# EAGLE design stair light controller (EAGLE 6.2)
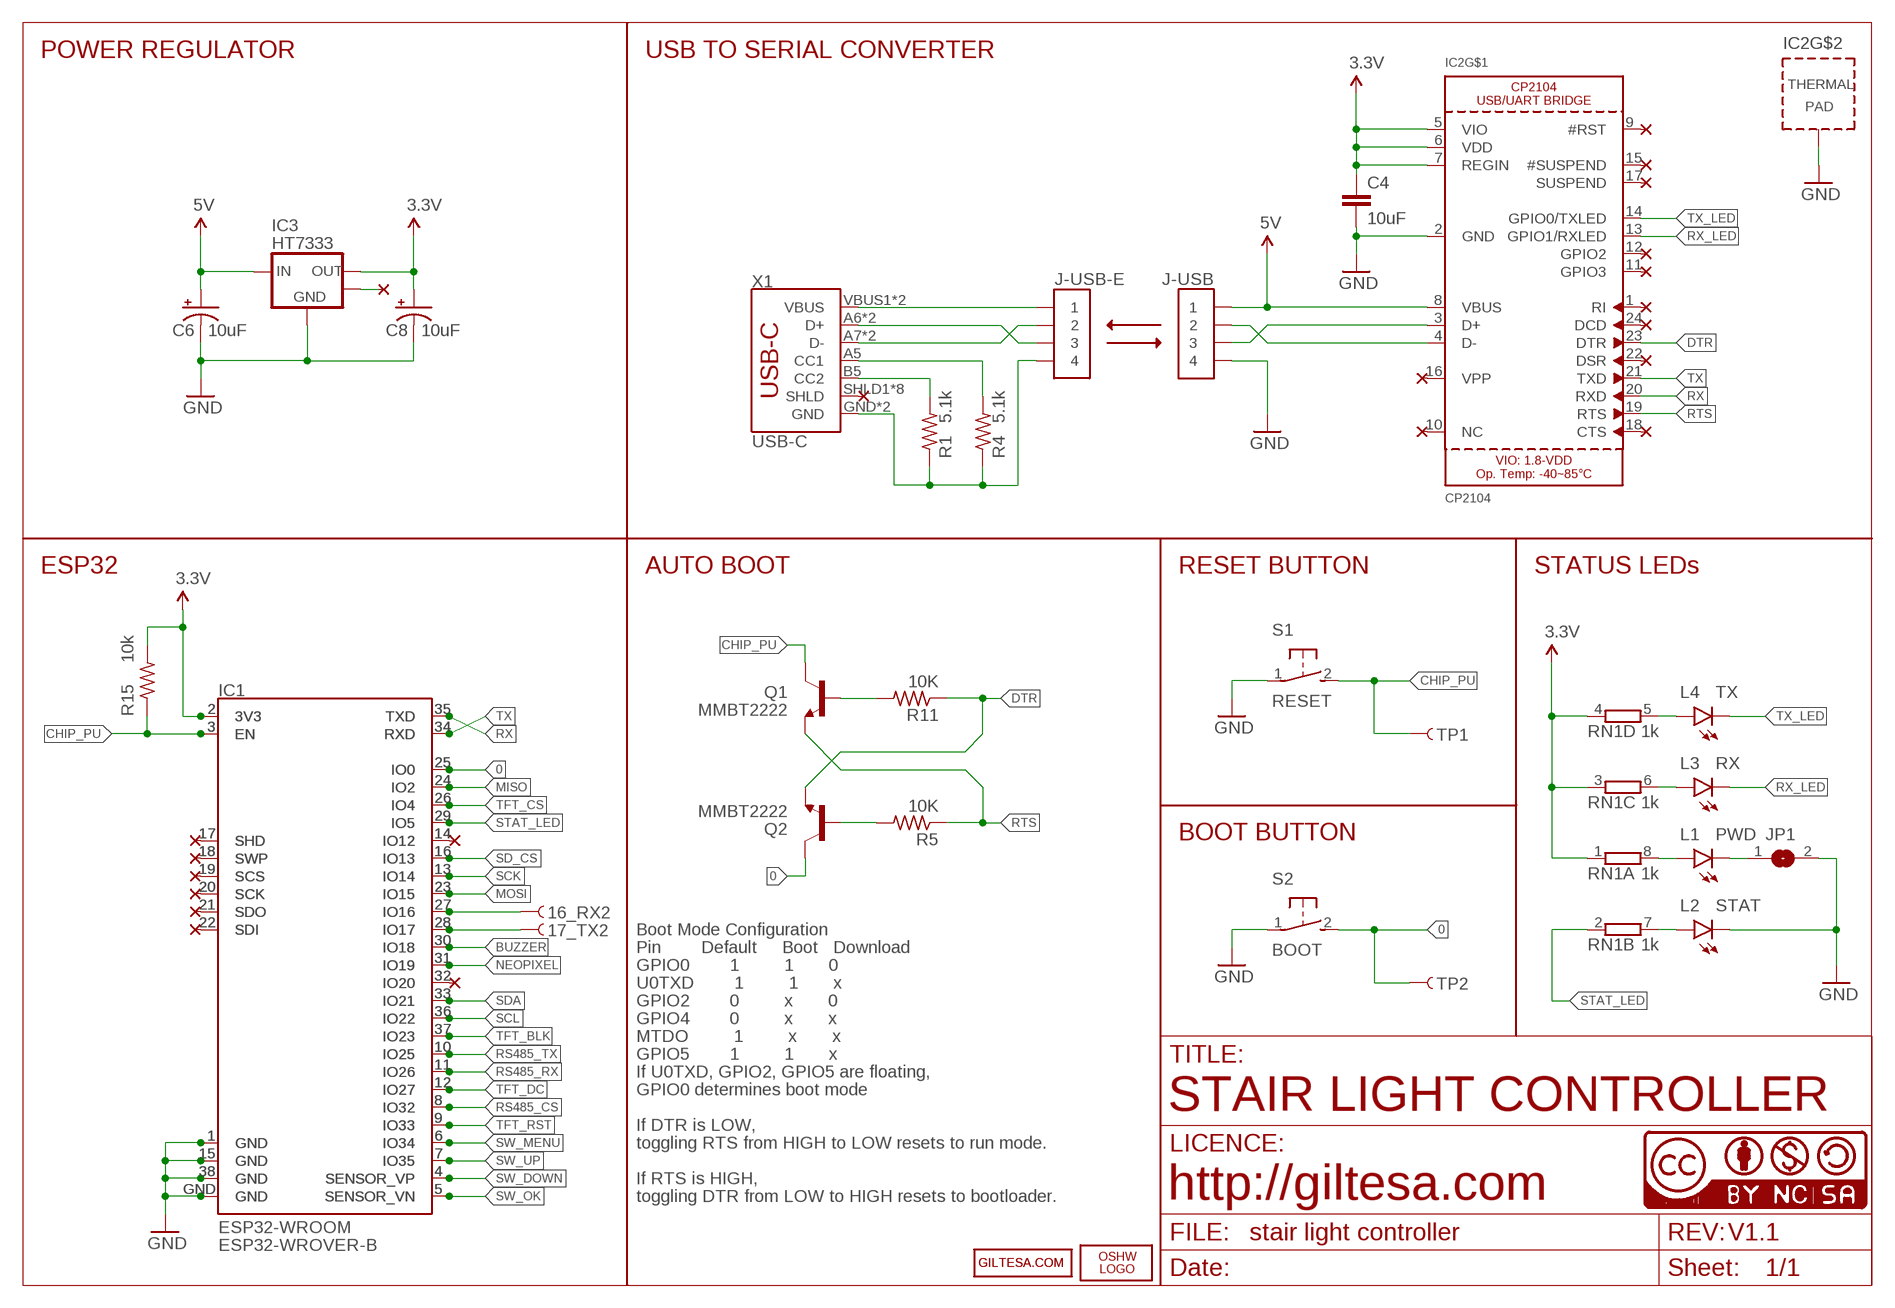
[diagram p0: schematic, sheet 1, part 1 of 2]
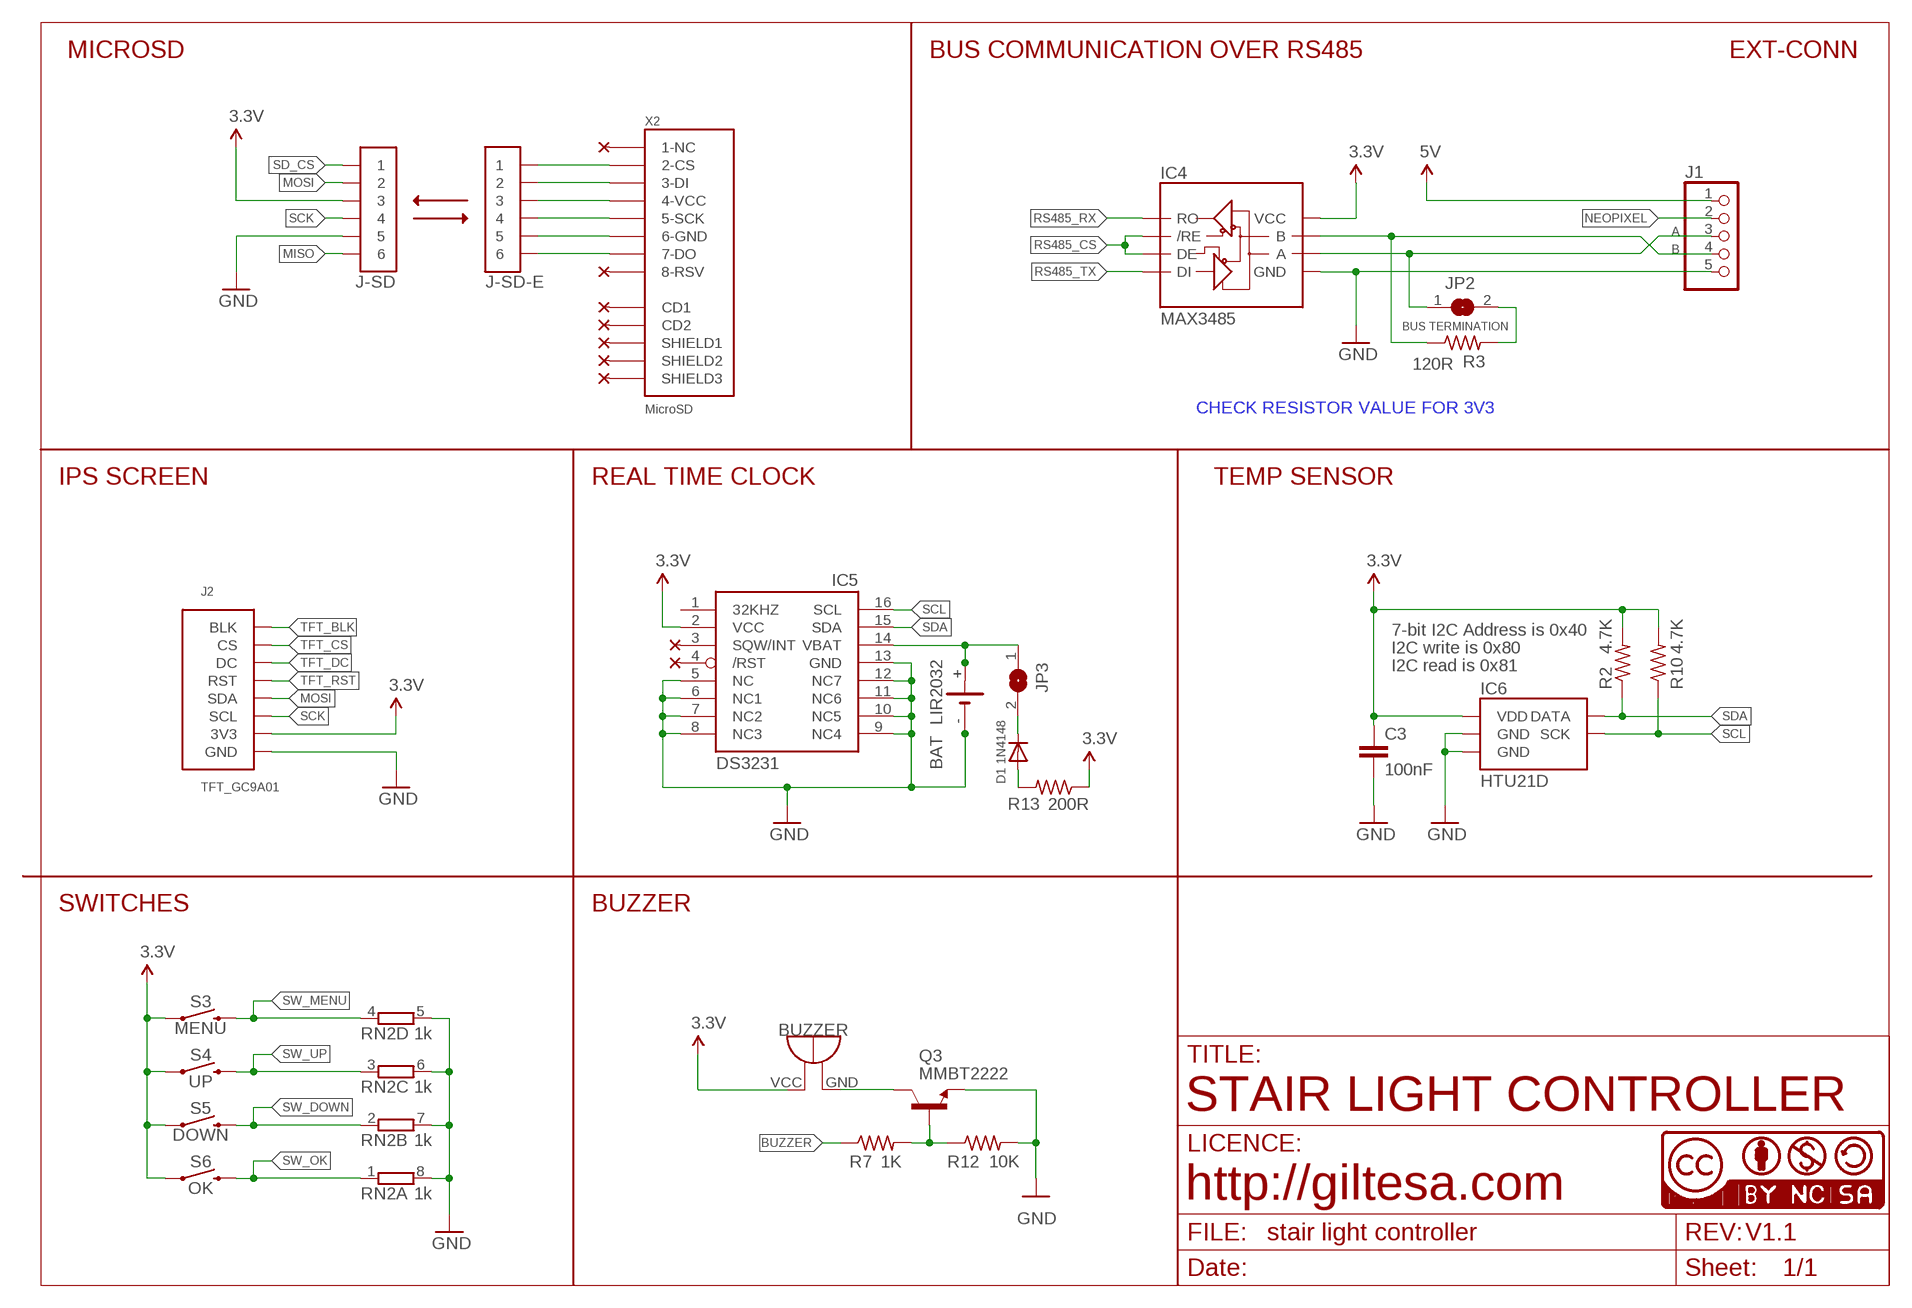
[diagram p1: schematic, sheet 1, part 2 of 2]

## Parts
16_RX2  TEST-POINTTP_15TH_THRU  [TP_15TH]
17_TX2  TEST-POINTTP_15TH_THRU  [TP_15TH]
BAT  LIR2032  LIR2032_SMD  [LIR2032_SMD]
BUZZER  BUZZER_9MM  [BUZZER_9MM]
C3  100nF  C0603  [C0603]
C4  10uF  C0805  [C0805]
C6  10uF  CAP_POL1206  [EIA3216]
C8  10uF  CAP_POL1206  [EIA3216]
D1  1N4148  DIODESOD-123  [SOD-123]
IC1  ESP32-WROVER-B  [ESP32-WROVER-B]
IC2  CP2104  [QFN24_4MM_SMSC]
IC3  HT7333  [SOT89_1]
IC4  MAX3485  RS485SOIC  [SO08]
IC5  DS3231  DS3231/SO  [SO16W]
IC6  HTU21D  HTU21DSMD  [HTU21D]
J1  PINHD-1X5  [1X05]
J2  TFT_GC9A01  LCD_GC9A01  [LCD_GC9A01]
J-SD  2X03  [2X03]
J-SD-E  2X03  [2X03]
J-USB  2X02  [2X02]
J-USB-E  2X02  [2X02]
JP1  JUMPER-SMD0402  [JUMPER-SMD_0402]
JP2  JUMPER-SMD0805  [JUMPER-SMD]
JP3  JUMPER-SMD0402  [JUMPER-SMD_0402]
L1  PWD  LED-BLUE0603  [LED-0603]
L2  STAT  LED-BLUE0603  [LED-0603]
L3  RX  LED-BLUE0603  [LED-0603]
L4  TX  LED-BLUE0603  [LED-0603]
LOGO1  OSHW_LOGO_FILLX0150-NT  [OSHW_FILLX150_NOTEXT]
Q1  MMBT2222  TRANSISTOR_NPNSOT23-3  [SOT23-3]
Q2  MMBT2222  TRANSISTOR_NPNSOT23-3  [SOT23-3]
Q3  MMBT2222  TRANSISTOR_NPNSOT23  [SOT23]
R1  5.1k  R0603  [R0603]
R2  4.7K  R0603  [R0603]
R3  120R  R0603  [R0603]
R4  5.1k  R0603  [R0603]
R5  10K  R0603  [R0603]
R7  1K  R0603  [R0603]
R10  4.7K  R0603  [R0603]
R11  10K  R0603  [R0603]
R12  10K  R0603  [R0603]
R13  200R  R0603  [R0603]
R15  10k  R0603  [R0603]
RN1  1k  4R-N0603-ARV  [0603-ARV]
RN2  1k  4R-N0603-ARV  [0603-ARV]
S1  RESET  SWITCH_2P4.6X2.8MM  [SWITCH_SMD_4.6X2.8MM]
S2  BOOT  SWITCH_2P4.6X2.8MM  [SWITCH_SMD_4.6X2.8MM]
S3  MENU  MOMENTARY-SWITCH-SPST-SMD-6.2MM-TALL  [TACTILE_SWITCH_SMD_6.2MM_TALL]
S4  UP  MOMENTARY-SWITCH-SPST-SMD-6.2MM-TALL  [TACTILE_SWITCH_SMD_6.2MM_TALL]
S5  DOWN  MOMENTARY-SWITCH-SPST-SMD-6.2MM-TALL  [TACTILE_SWITCH_SMD_6.2MM_TALL]
S6  OK  MOMENTARY-SWITCH-SPST-SMD-6.2MM-TALL  [TACTILE_SWITCH_SMD_6.2MM_TALL]
TP1  TEST-POINTTP_15TH_THRU  [TP_15TH]
TP2  TEST-POINTTP_15TH_THRU  [TP_15TH]
U1"  ESP32-WROOM  ESP32-WROOMNARROW  [ESP32-WROOM-NARROW]
U$5  CR2032SMT  [CR2032]
U$9  CC-NC-BCNIX  [CC-NC-B_NIX]
U$10  GILTESA.COM_COPPER  [GILTESA.COM_COPPER]
U$13  GILTESA.COM_MASK  [GILTESA.COM_MASK]
U$26  CC-NC-BCNIX  [CC-NC-B_NIX]
X1  USB-C  USB_C16PIN  [USB-C-16P]
X2  MicroSD  MICROSD_2  [MICROSD_2]

## Nets
0: IC1.25(IO0) Q2.3(C) S2.2(B) TP2.P$1 U1".25(IO0)
3.3V: BUZZER.VCC C3.1 C4.1 C8.A(+) IC1.2(3V3) IC2.5(VIO) IC2.6(VDD) IC2.7(REGIN) IC3.3(OUT) IC4.8(VCC) IC5.2(VCC) IC6.VDD J2.3V3 J2.3V3"(3V3) J-SD.3 R2.2 R10.2 R13.1 R15.2 RN1.1 RN1.3 RN1.4 S3.A2 S4.A2 S5.A2 S6.A2 U1".2(3V3)
5V: C6.A(+) IC2.8(VBUS) IC3.2(IN) J1.1 J-USB.1
12: IC1.14(IO12) U1".14(IO12)
16_NOT_DEV_PCB_RX2: 16_RX2.P$1 IC1.27(IO16) U1".27(IO16)
17_NOT_DEV_PCB_TX2: 17_TX2.P$1 IC1.28(IO17) U1".28(IO17)
A: IC4.6(A) J1.3 JP2.1
B: IC4.7(B) J1.4 R3.1
BUZZER: IC1.30(IO18) R7.1 U1".30(IO18)
CHIP_PU: IC1.3(EN) Q1.3(C) R15.1 S1.2(B) TP1.P$1 U1".3(EN)
D+: IC2.3(D+) J-USB.3
D-: IC2.4(D-) J-USB.2
DTR: IC2.23(DTR) Q2.2(E) R11.1
EXT_PCB_3.3V: J-SD-E.3 X2.4-VCC
EXT_PCB_5V: J-USB-E.1 X1.VBUS1(VBUS) X1.VBUS2(VBUS)
EXT_PCB_CC1: R4.2 X1.A5(CC1)
EXT_PCB_CC2: R1.2 X1.B5(CC2)
EXT_PCB_D+: J-USB-E.3 X1.A6(D+) X1.B6(D+)
EXT_PCB_D-: J-USB-E.2 X1.A7(D-) X1.B7(D-)
EXT_PCB_GND: J-SD-E.5 J-USB-E.4 R1.1 R4.1 X1.GND X1.GND2(GND) X2.6-GND
EXT_PCB_MISO: J-SD-E.6 X2.7-DO
EXT_PCB_MOSI: J-SD-E.2 X2.3-DI
EXT_PCB_SCK: J-SD-E.4 X2.5-SCK
EXT_PCB_SD_CS: J-SD-E.1 X2.2-CS
GND: BAT.- C3.2 C4.2 C6.C(-) C8.C(-) IC1.1(GND) IC1.15(GND) IC1.38(GND) IC1.GND IC2.2(GND) IC2.THERM(TP) IC3.1(GND) IC4.5(GND) IC5.5(NC) IC5.6(NC1) IC5.7(NC2) IC5.8(NC3) IC5.9(NC4) IC5.10(NC5) IC5.11(NC6) IC5.12(NC7) IC5.13(GND) IC6.7(GND) IC6.GND J1.5 J2.GND J2.GND"(GND) J-SD.5 J-USB.4 JP1.2 L2.C Q3.2(E) R12.2 RN2.5 RN2.6 RN2.7 RN2.8 S1.1(A) S2.1(A) U1".1(GND) U1".15(GND) U1".38(GND) U1".GND U$5.-
MISO: IC1.24(IO2) J-SD.6 U1".24(IO2)
MOSI: IC1.23(IO15) J2.SDA J2.SDA"(SDA) J-SD.2 U1".23(IO15)
N$1: L1.A RN1.8
N$2: L2.A RN1.7
N$3: IC3.4(NC)
N$4: BAT.+ IC5.14(VBAT) JP3.1 U$5.+
N$5: D1.A R13.2
N$6: L4.A RN1.5
N$7: L3.A RN1.6
N$13: JP1.1 L1.C
N$14: JP2.2 R3.2
N$15: Q3.1(B) R7.2 R12.1
N$18: IC1.32(IO20) U1".32(IO20)
N$19: BUZZER.GND Q3.3(C)
N$27: IC1.20(SCK) U1".20(SCK)
N$28: IC1.19(SCS) U1".19(SCS)
N$29: IC1.22(SDI) U1".22(SDI)
N$30: IC1.21(SDO) U1".21(SDO)
N$33: IC1.17(SHD) U1".17(SHD)
N$34: IC1.18(SWP) U1".18(SWP)
N$35: D1.C JP3.2
N$40: Q1.1(B) R11.2
N$41: Q2.1(B) R5.2
NEOPIXEL: IC1.31(IO19) J1.2 U1".31(IO19)
RS485_CS: IC1.8(IO32) IC4.2(/RE) IC4.3(DE) U1".8(IO32)
RS485_RX: IC1.11(IO26) IC4.1(RO) U1".11(IO26)
RS485_TX: IC1.10(IO25) IC4.4(DI) U1".10(IO25)
RTS: IC2.19(RTS) Q1.2(E) R5.1
RX: IC1.35(TXD) IC2.20(RXD) U1".35(TXD)
RX_LED: IC2.13(GPIO1/RXLED) L3.C
SCK: IC1.13(IO14) J2.SCL J2.SCL"(SCL) J-SD.4 U1".13(IO14)
SCL: IC1.36(IO22) IC5.16(SCL) IC6.SCK R10.1 U1".36(IO22)
SD_CS: IC1.16(IO13) J-SD.1 U1".16(IO13)
SDA: IC1.33(IO21) IC5.15(SDA) IC6.DATA R2.1 U1".33(IO21)
STAT_LED: IC1.29(IO5) RN1.2 U1".29(IO5)
SW_DOWN: IC1.4(SENSOR_VP) RN2.2 S5.B2 U1".4(SENSOR_VP)
SW_MENU: IC1.6(IO34) RN2.4 S3.B2 U1".6(IO34)
SW_OK: IC1.5(SENSOR_VN) RN2.1 S6.B2 U1".5(SENSOR_VN)
SW_UP: IC1.7(IO35) RN2.3 S4.B2 U1".7(IO35)
TFT_BLK: IC1.37(IO23) J2.BLK J2.BLK"(BLK) U1".37(IO23)
TFT_CS: IC1.26(IO4) J2.CS J2.CS"(CS) U1".26(IO4)
TFT_DC: IC1.12(IO27) J2.DC J2.DC"(DC) U1".12(IO27)
TFT_RST: IC1.9(IO33) J2.RST J2.RST"(RST) U1".9(IO33)
TX: IC1.34(RXD) IC2.21(TXD) U1".34(RXD)
TX_LED: IC2.14(GPIO0/TXLED) L4.C
Unconnected: IC2.1(RI) IC2.9(#RST) IC2.10(NC) IC2.11(GPIO3) IC2.12(GPIO2) IC2.15(#SUSPEND) IC2.16(VPP) IC2.17(SUSPEND) IC2.18(CTS) IC2.22(DSR) IC2.24(DCD) IC5.1(32KHZ) IC5.3(SQW/INT) IC5.4(/RST) X1.SHLD1(SHLD) X1.SHLD2(SHLD) X1.SHLD3(SHLD) X1.SHLD4(SHLD) X1.SHLD5(SHLD) X1.SHLD6(SHLD) X1.SHLD7(SHLD) X1.SHLD8(SHLD) X2.1-NC X2.8-RSV X2.CD1 X2.CD2 X2.SHIELD1 X2.SHIELD2 X2.SHIELD3

## Notes on the sheet
- POWER REGULATOR | USB TO SERIAL CONVERTER | MICROSD | BUS COMMUNICATION OVER RS485 | EXT-CONN
- BUS TERMINATION
- CHECK RESISTOR VALUE FOR 3V3
- IPS SCREEN | REAL TIME CLOCK | TEMP SENSOR
- ESP32 | AUTO BOOT | RESET BUTTON | STATUS LEDs
- 7-bit I2C Address is 0x40
- I2C write is 0x80
- I2C read is 0x81
- BOOT BUTTON
- SWITCHES | BUZZER
- Boot Mode Configuration
- Pin        Default     Boot   Download
- GPIO0        1         1       0
- U0TXD        1         1       x
- GPIO2        0         x       0
- GPIO4        0         x       x
- MTDO         1         x       x
- GPIO5        1         1       x
- If U0TXD, GPIO2, GPIO5 are floating,
- GPIO0 determines boot mode
- STAIR LIGHT CONTROLLER | STAIR LIGHT CONTROLLER
- If DTR is LOW,
- toggling RTS from HIGH to LOW resets to run mode.
- If RTS is HIGH,
- toggling DTR from LOW to HIGH resets to bootloader. | http://giltesa.com | http://giltesa.com
- V1.1 | V1.1

## Library data of the parts
16_RX2 17_TX2 TP1 TP2 = SparkFun-Connectors:TEST-POINT: SparkFun Test Points Bare copper test points for troubleshooting or In-Circuit-Testing. These are used by our Production team for verifying production board runs using pogo-pins on test beds. SparkFun Products: SparkFun LSM9DS1 Breakout <https://www.sparkfun.com/products/13284> SparkFun PSOC <https://www.sparkfun.com/products/13714> SparkFun Load Cell Amplifier <https://www.sparkfun.com/products/13879>
BAT = ,giltesa:LIR2032_SMD
BUZZER = ,giltesa:BUZZER
C3 = ,giltesa:C0603
C4 = ,giltesa:C0805
C6 C8 = SparkFun:CAP_POL: Capacitor Polarized These are standard SMD and PTH capacitors. Normally 10uF, 47uF, and 100uF in electrolytic and tantalum varieties. Always verify the external diameter of the through hole cap, it varies with capacity, voltage, and manufacturer. The EIA devices should be standard.
D1 = adafruit:DIODE: Diode SMADIODE - SMA Surface Mount Package 20V 1A Schottky Diode Digikey: 641-1014-6-ND DO-1N4148 - Through Hole Small Current Diode SOD-123 20V 1 A (.5mV Vf) Schottky Diode - Digikey: MBRX120TPMSCT-ND SOD-323 10V 570mA (.38mV Vf, 3ns) Schottky Diode - Digikey: ZLLS410CT-ND SOD-523 30V 30mA Schottky Diode (RB751S-40TE61) - Digikey: RB751S-40TE61CT-ND SOT23-R/W - SOT23 Package (R = Solder Paste/Reflow Ovens, W = Hand-Soldering) BAT54Film 40V 300mA - Digikey: 497-7162-1-ND
IC1 = ,giltesa:ESP32-WROVER-B
IC2 = microbuilder:CP2104: CP2104 - USB to UART Bridge VDD Output: 3.45V
IC3 = ,giltesa:HT7
IC4 = SparkFun-DigitalIC:RS485: RS485 transceiver
IC5 = adafruit:DS3231
IC6 = SparkFun-Sensors:HTU21D
J1 = pinhead:PINHD-1X5: PIN HEADER
J2 = ,giltesa:LCD_GC9A01
J-SD J-SD-E = ,giltesa:2X03
J-USB J-USB-E = ,giltesa:2X02
JP1-JP3 = ,giltesa:JUMPER-SMD
L1-L4 = SparkFun-LED:LED-BLUE: Blue SMD LED Used in manufacturing of various products at SparkFun Packages: 0603 - SMD 0603 package [Product Link] <http://www.digikey.com/product-detail/en/SMLE12BC7TT86/511-1589-2-ND/1641808> 1206 - SMD1206 package [Product Link] <http://www.digikey.com/product-detail/en/lite-on-inc/LTST-C150TBKT/160-1643-1-ND/573584> SparkFun Products: ESP8266 Thing-Dev Board <https://www.sparkfun.com/products/13711> RedBoard <https://www.sparkfun.com/products/12757>; PROD_ID: DIO-08575; VALUE: BLUE
LOGO1 = ohw-logo:OSHW_LOGO_FILL
Q1-Q3 = SparkFun:TRANSISTOR_NPN: Transistor NPN BJT configuration in SOT23 package. MMBT2222 is the common NPN we use. Double check BCE configuration again layout.
R1-R5 R7 R10-R13 R15 = ,giltesa:R0603
RN1 RN2 = resistor-dil:4R-N: Array Chip Resistor Source: RS Component / Phycomp; OC_FARNELL: unknown; OC_NEWARK: unknown
S1 S2 = ,giltesa:SWITCH_2P
S3-S6 = SparkFun-Switches:MOMENTARY-SWITCH-SPST: Momentary Switch (Pushbutton) - SPST Normally-open (NO) SPST momentary switches (buttons, pushbuttons). Variants PTH-12MM - 12mm square, through-hole Momentary Pushbutton Switch - 12mm Square <https://www.sparkfun.com/products/9190> (COM-09190) PTH-6.0MM, PTH-6.0MM-KIT - 6.0mm square, through-hole Mini Pushbutton Switch <https://www.sparkfun.com/products/97> (COM-00097) KIT package intended for soldering kit's - only one side of pads' copper is exposed. PTH-RIGHT-ANGLE-KIT - Right-angle, through-hole Right Angle Tactile Button <https://www.sparkfun.com/products/10791> - Used on SparkFun BigTime Watch Kit <https://www.sparkfun.com/products/11734> SMD-12MM - 12mm square, surface-mount Tactile Button - SMD (12mm) <https://www.sparkfun.com/products/12993> (COM-12993) Used on SparkFun PicoBoard <https://www.sparkfun.com/products/11888> SMD-4.5MM - 4.5mm Square Trackball Switch Used on SparkFun Blackberry Trackballer Breakout <https://www.sparkfun.com/products/13169> SMD-4.6MMX2.8MM - 4.60mm x 2.80mm, surface mount Used on SparkFun SAMD21 Mini Breakout <https://www.sparkfun.com/products/13664> SMD-5.2MM, SMD-5.2-REDUNDANT - 5.2mm square, surface-mount Mini Pushbutton Switch - SMD <https://www.sparkfun.com/products/8720> (COM-08720) Used on Arduino Pro Mini <https://www.sparkfun.com/products/11114> REDUNDANT package connects both switch circuits together SMD-6.0X3.5MM - 6.0 x 3.5mm, surface mount Momentary Reset Switch SMD <https://www.sparkfun.com/products/8229> (COM-08229) SMD-6.2MM-TALL - 6.2mm square, surface mount Tactile Button - SMD (6mm) <https://www.sparkfun.com/products/12992> Used on SparkFun Digital Sandbox <https://www.sparkfun.com/products/12651> SMD-RIGHT-ANGLE - Right-angle, surface mount Used on SparkFun Block for Intel® Edison - Arduino <https://www.sparkfun.com/products/13036>; PROD_ID: SWCH-11966; SF_SKU: COM-12992
U1" = ,giltesa:ESP32-WROOM; PROD_ID: IC-13849
U$5 = ,giltesa:CR2032
U$9 U$26 = cc-by-nc-sa:CC-NC-BC: All hardware is licensed under the Creative Commons Attribution-Noncommercial-Share Alike 2.5 Switzerland License. To view a copy of this license, visit http://creativecommons.org/licenses/by-nc-sa/2.5/ch/ or send a letter to Creative Commons, 171 Second Street, Suite 300, San Francisco, California, 94105, USA.
U$10 U$13 = ,giltesa_logos:GILTESA.COM
X1 = SparkFun-Connectors:USB_C: USB Type C 16Pin Connector Super Speed pins not available on the 16-pin purely SMD connector so this part is best for USB 2.0 implementations. D1 and D2 are tied together enabling D+/- no matter which way the cable is plugged into the connector. The two channel configuration pins (CC1/2) are exposed. These are normally connected to ground via 5.1k resistors but can be reconfigured for high current/high power applications.; PROD_ID: CONN-14122
X2 = ,giltesa:MICROSD_2

## Net classes
1 power: width 0.178 mm
2 gnd: width 0.305 mm, drill 0.406 mm, clearance 0.203 mm
3 power usb: width 0.508 mm, drill 0.406 mm, clearance 0.203 mm
4 aref: width 0.254 mm, drill 0.61 mm, clearance 0.254 mm

## Board
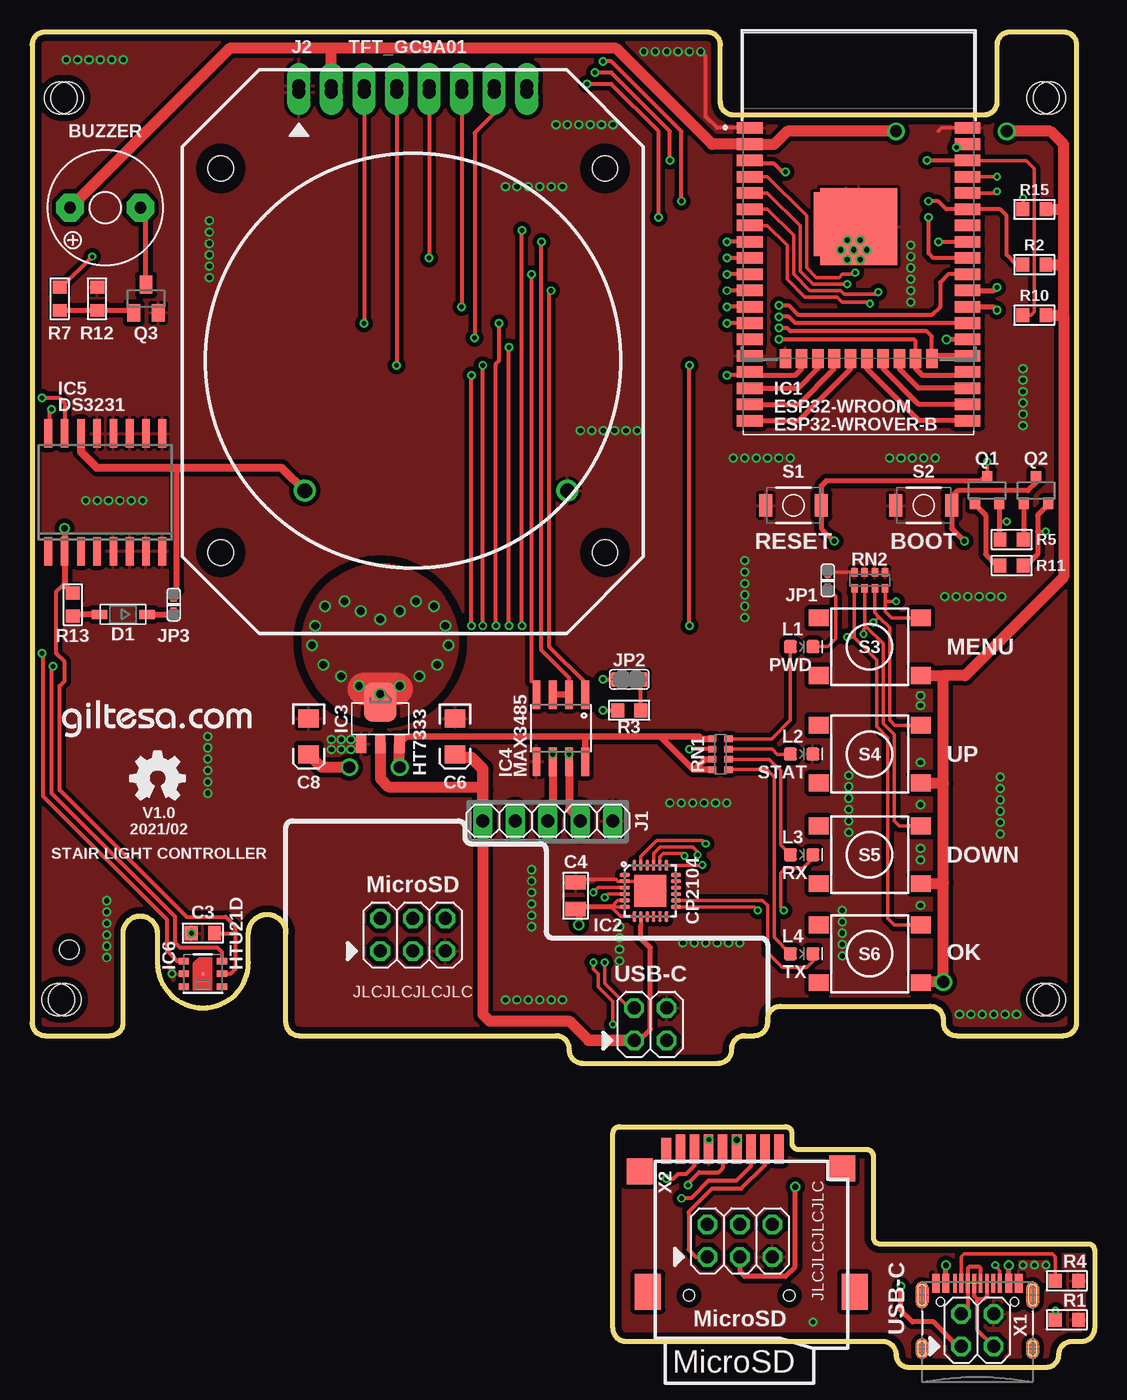
[diagram p2: board, top side]
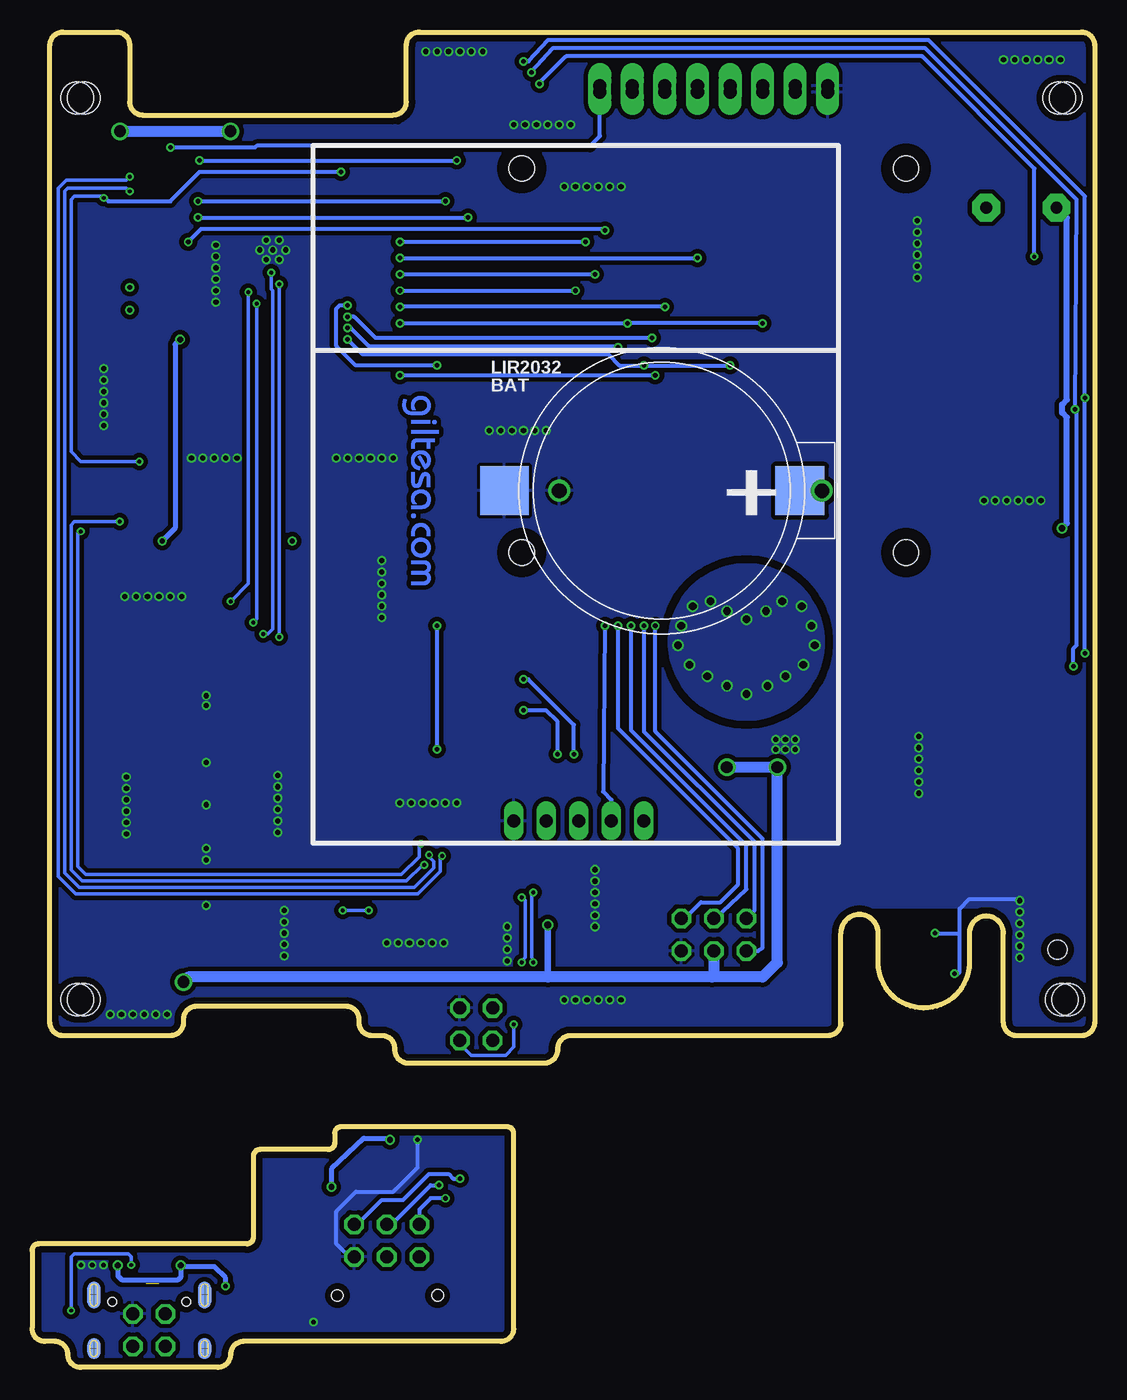
[diagram p3: board, bottom side, seen from below]

Size 82.93 x 104.27 mm. Coordinates in mm from the lower left corner, seen from the top.
Outline: 7.11,33.91 arc-180 9.78,33.91 9.78,31.62 arc180 16.89,31.62 16.89,33.91 arc-180 19.81,33.91 19.81,26.92 arc90 20.83,25.91 40.89,25.91 arc-90 41.91,24.89 arc90 42.93,23.75 53.59,23.75 arc90 54.61,24.89 arc-90 55.63,25.91 56.39,25.91 arc90 57.4,26.92 57.4,27.18 arc-90 58.42,28.19 70.1,28.19 arc-90 71.12,27.18 71.12,26.92 arc90 72.14,25.91 80.52,25.91 arc90 81.53,26.92 81.53,103.25 arc90 80.52,104.27 76.33,104.27 arc90 75.31,103.25 75.31,98.81 arc-90 74.3,97.79 54.74,97.79 arc-90 53.72,98.81 53.72,103.25 arc90 52.7,104.27 1.02,104.27 arc90 0,103.25 0,26.92 arc90 1.02,25.91 6.1,25.91 arc90 7.11,26.92 7.11,33.91
Outline: 45.34,3.05 arc90 46.35,2.03 66.42,2.03 arc-90 67.44,1.02 arc90 68.45,0 79.12,0 arc90 80.14,1.02 arc-90 81.15,2.03 81.92,2.03 arc90 82.93,3.05 82.93,9.14 arc90 82.42,9.65 66.17,9.65 arc-90 65.66,10.16 65.66,16.51 arc90 65.15,17.02 59.82,17.02 arc-90 59.31,17.53 59.31,18.29 arc90 58.8,18.8 45.85,18.8 arc90 45.34,18.29 45.34,3.05
Copper layers (1*16): Top 0.035mm / dielectric 1.6mm / Bottom 0.035mm
Design rules: minimum track width 6mil, minimum drill 12mil, track to track 6mil, track to pad 6mil, pad to pad 6mil, via to via 8mil, smd to smd 0mil, copper to edge 20mil, drill to drill 10mil, minimum pad ring 6mil, minimum via ring 6mil, stop-mask expansion 0mil, vias tented up to drill 100mil, thermal gap 10mil
Holes 2.54 mm at 2.05,28.72 2.25,99.12 78.9,28.72 78.9,99.12 2.75,99.12 2.55,28.72 79.41,99.12 79.41,28.72
Holes 1.52 mm at 2.9,32.62
tRestrict: 4 lines
bRestrict: area 9.4,27.7 to 17.3,35.3; 4 lines

### Footprints (pad centres in the part's own frame; a part is rotated, then mirrored left to right if it is on the bottom)
TP_15TH = drill 0.381 pad 0.61: P$1 0,0
LIR2032_SMD = smd 3.81 x 3.81: + 10.78,0; - -12.28,0
BUZZER_9MM = drill 0.914 pad 2.159 octagon: GND -2.743,0; VCC 2.743,0
C0603 = smd 1 x 1.1: 1 -0.901,0; 2 0.901,0
C0805 = smd 1.1 x 1.6: 1 -1.05,0; 2 1.05,0
EIA3216 = smd 1.4 x 1.6: A 1.4,0; C -1.4,0
SOD-123 = smd 1.2 x 0.7: A 1.85,0; C -1.85,0
ESP32-WROVER-B = smd 2 x 0.9: 1 -8.5,8.26; 2 -8.5,6.99; 3 -8.5,5.72; 4 -8.5,4.45; 5 -8.5,3.18; 6 -8.5,1.91; 7 -8.5,0.64; 8 -8.5,-0.63; 9 -8.5,-1.9; 10 -8.5,-3.17; 11 -8.5,-4.44; 12 -8.5,-5.71; 13 -8.5,-6.98; 14 -8.5,-8.25; 15 -8.5,-9.52; 16 -8.5,-10.79; 17 -8.5,-12.06; 18 -8.5,-13.33; 19 -8.5,-14.6; 20 8.5,-14.6; 21 8.5,-13.33; 22 8.5,-12.06; 23 8.5,-10.79; 24 8.5,-9.52; 25 8.5,-8.25; 26 8.5,-6.98; 27 8.5,-5.71; 28 8.5,-4.44; 29 8.5,-3.17; 30 8.5,-1.9; 31 8.5,-0.63; 32 8.5,0.64; 33 8.5,1.91; 34 8.5,3.18; 35 8.5,4.45; 36 8.5,5.72; 37 8.5,6.99; 38 8.5,8.26 | smd 5 x 5: GND -1,0.76
QFN24_4MM_SMSC = smd 0.8 x 0.28: 1 -2,1.25; 2 -2,0.75; 3 -2,0.25; 4 -2,-0.25; 5 -2,-0.75; 6 -2,-1.25; 13 2,-1.25; 14 2,-0.75; 15 2,-0.25; 16 2,0.25; 17 2,0.75; 18 2,1.25 | smd 0.28 x 0.8: 7 -1.25,-2; 8 -0.75,-2; 9 -0.25,-2; 10 0.25,-2; 11 0.75,-2; 12 1.25,-2; 19 1.25,2; 20 0.75,2; 21 0.25,2; 22 -0.25,2; 23 -0.75,2; 24 -1.25,2 | smd 2.5 x 2.5: THERM 0,0
SOT89_1 = smd 0.8 x 1.4: 1 -1.499,-1.981; 2 0,-1.981; 3 1.499,-1.981 | smd 2.54 x 3.048: 4 0,1.27
SO08 = smd 0.61 x 2.21: 1 -1.905,-2.616; 2 -0.635,-2.616; 3 0.635,-2.616; 4 1.905,-2.616; 5 1.905,2.616; 6 0.635,2.616; 7 -0.635,2.616; 8 -1.905,2.616
SO16W = smd 0.6 x 2.2: 1 -4.445,-4.6; 2 -3.175,-4.6; 3 -1.905,-4.6; 4 -0.635,-4.6; 5 0.635,-4.6; 6 1.905,-4.6; 7 3.175,-4.6; 8 4.445,-4.6; 9 4.445,4.6; 10 3.175,4.6; 11 1.905,4.6; 12 0.635,4.6; 13 -0.635,4.6; 14 -1.905,4.6; 15 -3.175,4.6; 16 -4.445,4.6
HTU21D = smd 0.2 x 0.2: 7 0,0 | smd 0.8 x 0.5: DATA 1.5,-1; GND 1.5,0; NC@1 -1.5,1; NC@6 1.5,1; SCK -1.5,-1; VDD -1.5,0
1X05 = drill 1.016 long: 1 -5.08,0; 2 -2.54,0; 3 0,0; 4 2.54,0; 5 5.08,0
LCD_GC9A01 = drill 1.016 pad 1.778 long: 3V3 -6.35,21.454; 3V3" -6.35,20.946; BLK 8.89,21.454; BLK" 8.89,20.946; CS 6.35,21.454; CS" 6.35,20.946; DC 3.81,21.454; DC" 3.81,20.946; GND -8.89,21.454; GND" -8.89,20.946; RST 1.27,21.454; RST" 1.27,20.946; SCL -3.81,21.454; SCL" -3.81,20.946; SDA -1.27,21.454; SDA" -1.27,20.946 | hole 2: -15,-15; 15,-15; -15,15; 15,15
2X03 = drill 1.016 octagon: 1 -2.54,-1.27; 2 -2.54,1.27; 3 0,-1.27; 4 0,1.27; 5 2.54,-1.27; 6 2.54,1.27
2X02 = drill 1.016 octagon: 1 -1.27,-1.27; 2 -1.27,1.27; 3 1.27,-1.27; 4 1.27,1.27
JUMPER-SMD_0402 = smd 0.7 x 0.5: 1 -0.584,0; 2 0.584,0
JUMPER-SMD = smd 1.15 x 1.1: 1 -0.838,0; 2 0.838,0
LED-0603 = smd 1 x 1: A -0.877,0; C 0.877,0
SOT23-3 = smd 0.8 x 0.9: 1 -0.95,-1; 2 0.95,-1; 3 0,1.1
SOT23 = smd 1 x 1.4: 1 -0.95,-1.1; 2 0.95,-1.1; 3 0,1.1
R0603 = smd 1 x 1.1: 1 -0.901,0; 2 0.901,0
0603-ARV = smd 0.5 x 0.65: 1 -1.2,-0.625; 2 -0.4,-0.625; 3 0.4,-0.625; 4 1.2,-0.625; 5 1.2,0.625; 6 0.4,0.625; 7 -0.4,0.625; 8 -1.2,0.625
SWITCH_SMD_4.6X2.8MM = smd 1.016 x 1.778: 1 -2.177,0; 2 2.177,0
TACTILE_SWITCH_SMD_6.2MM_TALL = smd 1.55 x 1.3: A1 -3.975,-2.25; A2 3.975,-2.25; B1 -3.975,2.25; B2 3.975,2.25
ESP32-WROOM-NARROW = smd 1.5 x 0.9: 1 -8.238,6.43; 2 -8.238,5.16; 3 -8.238,3.89; 4 -8.238,2.62; 5 -8.238,1.35; 6 -8.238,0.08; 7 -8.238,-1.19; 8 -8.238,-2.46; 9 -8.238,-3.73; 10 -8.238,-5; 11 -8.238,-6.27; 12 -8.238,-7.54; 13 -8.238,-8.81; 14 -8.238,-10.08; 25 8.238,-10.08; 26 8.238,-8.81; 27 8.238,-7.54; 28 8.238,-6.27; 29 8.238,-5; 30 8.238,-3.73; 31 8.238,-2.46; 32 8.238,-1.19; 33 8.238,0.08; 34 8.238,1.35; 35 8.238,2.62; 36 8.238,3.89; 37 8.238,5.16; 38 8.238,6.43 | smd 0.9 x 1.5: 15 -5.715,-11.57; 16 -4.445,-11.57; 17 -3.175,-11.57; 18 -1.905,-11.57; 19 -0.635,-11.57; 20 0.635,-11.57; 21 1.905,-11.57; 22 3.175,-11.57; 23 4.445,-11.57; 24 5.715,-11.57 | smd 6 x 6: GND 0,-1.27
CR2032 = drill 1.143: + -12.5,0; - 8,0
USB-C-16P = smd 0.3 x 1.45: A5 -1.25,0; A6 -0.25,0; A7 0.25,0; A8 1.25,0; B5 1.75,0; B6 0.75,0; B7 -0.75,0; B8 -1.75,0 | smd 0.6 x 1.45: GND -3.225,0; GND2 3.225,0 | smd 1 x 2.1: SHLD1 -4.32,-0.915; SHLD2 4.32,-0.915 | smd 1 x 2.1 bottom: SHLD3 -4.32,-0.915; SHLD4 4.32,-0.915 | smd 1 x 1.6: SHLD5 -4.32,-5.095; SHLD8 4.32,-5.095 | smd 1 x 1.6 bottom: SHLD6 -4.32,-5.095; SHLD7 4.32,-5.095 | smd 0.55 x 1.45: VBUS1 -2.45,0; VBUS2 2.45,0 | hole 0.65: -2.89,-1.445; 2.89,-1.445
MICROSD_2 = smd 2.286 x 0.75: 1-NC -0.963,9.652; 2-CS -0.963,8.552; 3-DI -0.963,7.452; 4-VCC -0.963,6.352; 5-SCK -0.963,5.252; 6-GND -0.963,4.152; 7-DO -0.963,3.052; 8-RSV -0.963,1.952 | smd 2.033 x 0.75: CD1 -0.836,0.852 | smd 2.032 x 2.032: CD2 0.773,-1.22; SHIELD1 0.519,14.578 | smd 2.794 x 2.032: SHIELD2 10.171,15.544; SHIELD3 10.171,-0.585 | hole 0.9: 10.45,2.62; 10.46,10.45

### Placement (x,y rotation side)
16_RX2  75.31,82.55 180 top
17_TX2  75.31,84.33 180 top
BAT  33.78,68.45 0 bottom
BUZZER  5.71,90.55 180 top
C3  13.34,33.91 180 top
C4  42.42,36.83 90 top
C6  33.02,49.28 270 top
C8  21.59,49.28 270 top
D1  7.11,58.8 180 top
IC1  64.52,88.52 0 top
IC2  48.26,37.21 0 top
IC3  27.18,50.67 0 top
IC4  41.27,49.91 180 top
IC5  5.71,68.33 0 top
IC6  13.34,30.73 180 top
J1  40.26,42.67 0 top
J2  29.72,78.61 0 top
J-SD  29.72,33.78 0 top
J-SD-E  55.24,9.91 0 top
J-USB  48.26,26.8 0 top
J-USB-E  73.79,2.92 0 top
JP1  62.1,61.46 90 top
JP2  46.61,53.72 0 top
JP3  11.05,59.56 270 top
L1  60.07,56.27 0 top
L2  60.07,47.89 0 top
L3  60.07,40.03 0 top
L4  60.07,32.3 0 top
LOGO1  7.67,44.32 0 top
Q1  74.55,68.45 0 top
Q2  78.36,68.45 0 top
Q3  8.89,83.44 0 top
R1  80.77,3.73 180 top
R2  78.23,86.11 0 top
R3  46.61,51.31 0 top
R4  80.77,6.78 180 top
R5  76.45,64.64 0 top
R7  2.16,83.44 270 top
R10  78.23,82.17 0 top
R11  76.45,62.61 180 top
R12  5.08,83.44 90 top
R13  3.17,59.56 270 top
R15  78.23,90.42 0 top
RN1  53.72,47.88 270 top
RN2  65.38,61.47 0 top
S1  59.44,67.31 0 top
S2  69.6,67.31 0 top
S3  65.38,56.27 0 top
S4  65.38,47.89 0 top
S5  65.38,40.03 0 top
S6  65.38,32.3 0 top
TP1  62.61,64.52 270 top
TP2  72.77,64.52 270 top
U1"  64.52,90.35 0 top
U$5  33.78,68.45 180 bottom
U$9  -0.03,26.42 0 top
U$10  54.1,75.95 270 bottom
U$13  2.26,49.15 0 top
U$26  0,26.42 0 top
X1  73.78,6.57 0 top
X2  48.65,16.08 270 top

### Tracks (layer width: path | path; a pad name or v marks a point on that pad's centre or on a via)
0  (via drill 0.46)
  Top 0.406: IC1.25 U1".25 v71.38,80.27 v71.37,80.26 | TP2.P$1 71.77,65.51 S2.2 71.75,67.33 71.75,67.95 72.26,68.45 77.72,68.45 78.36,69.09 Q2.3
  Bottom 0.406: v71.37,80.26 71.75,79.88 71.75,65.53 TP2.P$1
3.3V  (via drill 0.51, 0.56, 0.91)
  Top 0.254: IC2.6 45.23,35.96 | IC2.5 45.73,36.46 45.23,35.96 | 45.23,35.96 45.21,35.94 45.94,35.21 IC2.7
  Top 0.305: 15.88,34.04 15.88,34.42 15.11,35.18 12.06,35.18 2.16,45.09 2.16,53.21 2.54,53.59 2.54,55.12 1.91,55.75 1.91,60.58 2.54,61.21 | 15.88,34.04 15.88,31.12 15.49,30.73 IC6.VDD | C3.1 15.75,33.91 15.88,34.04
  Top 0.356: 42.71,35.94 C4.1
  Top 0.406: IC1.2 U1".2 | 45.21,35.94 42.58,35.94 C4.1
  Top 0.457: v2.54,65.53 IC5.2 2.54,61.21 2.54,61.1 R13.1
  Top 0.508: RN1.1 52.27,49.08 52.07,49.28 49.02,49.28 | 49.02,49.28 43.18,49.28 | 43.18,49.28 29.26,49.28 IC3.3 | IC4.8 43.18,49.28 | RN1.4 51.69,46.68 | 51.69,46.68 51.62,46.68 49.02,49.28 | RN1.3 52.49,47.48 51.69,46.68 | 42.71,35.94 42.71,34.83 v42.67,34.54
  Top 0.864: S6.A2 69.4,30.1 v71.12,30.1 71.12,37.85 | S5.A2 71.06,37.78 71.12,37.85 | v67.44,96.52 58.93,96.52 57.92,95.51 U1".2 53.08,95.51 45.59,103 23.5,103 | 23.5,103 15.42,103 BUZZER.VCC | 23.5,103 23.37,102.87 J2.3V3 J2.3V3" | 80.52,82.17 80.52,86.11 | 80.52,86.11 80.52,90.42 | 80.52,90.42 80.52,95.5 79.5,96.52 v76.07,96.52 | R10.2 80.52,82.17 | R2.2 80.52,86.11 | R15.2 80.52,90.42 | 80.52,82.17 80.52,61.72 72.82,54.02 71.12,54.02 | S3.A2 71.12,54.02 | v28.7,46.86 28.68,47.14 IC3.3 | v24.77,46.86 22.6,46.86 C8.A | 71.12,37.85 71.12,45.59 | 71.12,45.59 71.12,54.02 | S4.A2 71.07,45.64 71.12,45.59
  Bottom 0.457: BUZZER.VCC 2.16,89.74 2.16,75.56 2.54,75.18 2.54,74.55 2.16,74.17 2.16,65.91 v2.54,65.53
  Bottom 0.508: v42.67,34.54 42.67,30.48
  Bottom 0.864: 29.84,30.48 25.91,30.48 24.77,31.62 v24.77,46.86 v28.7,46.86 | 29.84,30.48 42.67,30.48 70.74,30.48 v71.12,30.1 | J-SD.3 29.72,30.61 29.84,30.48 | v76.07,96.52 v67.44,96.52
5V
  Top 0.305: IC2.8 47.51,34.53 47.52,34.52
  Top 0.406: J-USB.1 47.37,25.53 48.26,26.42 48.26,32.77 47.52,33.5 47.52,34.52
  Top 0.864: J1.1 35.18,27.56 35.69,27.05 41.91,27.05 43.43,25.53 | IC3.2 27.18,45.97 27.81,45.34 34.92,45.34 35.18,45.09
  Top 0.914: 43.43,25.53 J-USB.1 | J1.1 35.18,45.09 35.18,46.74 34.29,47.62 33.02,47.62 C6.A
12
  Top 0.406: U1".14 IC1.14
16_NOT_DEV_PCB_RX2
  Top 0.406: U1".27 IC1.27 75.05,82.81 16_RX2.P$1
17_NOT_DEV_PCB_TX2
  Top 0.406: U1".28 IC1.28 75.06,84.08 17_TX2.P$1
A  (via drill 0.36)
  Top 0.305: IC4.6 v40.64,47.88 | v44.58,53.72 JP2.1
  Top 0.61: IC4.6 40.64,43.05 J1.3
  Bottom 0.305: v40.64,47.88 40.64,50.16 44.2,53.72 v44.58,53.72
B  (via drill 0.36)
  Top 0.305: IC4.7 v41.91,47.88 | v44.58,51.31 R3.1
  Top 0.61: IC4.7 41.91,43.56 J1.4
  Bottom 0.305: v41.91,47.88 41.91,50.42 42.8,51.31 v44.58,51.31
BUZZER  (via drill 0.3, 0.36)
  Top 0.305: R7.1 2.3,84.34 v4.7,86.74 | U1".30 70.35,86.62 69.98,87 v69.98,89.79 | v48.9,89.79 48.9,96.52 45.21,100.2 v43.31,100.2
  Top 0.406: IC1.30 U1".30
  Bottom 0.305: v4.7,86.74 4.7,93.6 13.46,102.36 41.27,102.36 43.31,100.33 v43.31,100.2 | v69.98,89.79 v48.9,89.79
CHIP_PU  (via drill 0.3, 0.36)
  Top 0.254: Q1.3 v74.55,70.74 | v77.34,91.31 77.34,90.44 R15.1
  Top 0.305: v58.8,93.34 58.55,93.34 57.91,93.98 56.54,93.98 U1".3
  Top 0.406: IC1.3 U1".3 | TP1.P$1 61.61,65.51 S1.2 61.59,67.33 61.59,68.83 61.98,69.22 74.04,69.22 74.38,69.55 Q1.3
  Bottom 0.254: v74.55,70.74 79.12,70.74 79.88,71.5 79.88,91.19 79.63,91.44 77.47,91.44 v77.34,91.31
  Bottom 0.305: v77.34,91.31 77.22,91.31 76.96,91.06 72.14,91.06 69.85,93.34 v58.8,93.34
D+  (via drill 0.3)
  Top 0.254: v43.81,31.62 43.81,31.12 44.2,30.73 44.2,29.72 45.34,28.57 v45.34,26.8 | IC2.3 44.19,37.46 v43.81,37.08
  Bottom 0.254: J-USB.3 49.53,25.27 48.64,24.38 45.97,24.38 45.34,25.02 v45.34,26.8 | v43.81,31.62 43.81,31.88 43.94,32 43.94,36.96 v43.81,37.08
D-  (via drill 0.3)
  Top 0.254: IC2.4 44.96,36.96 v44.7,36.7 | J-USB.2 46.61,28.07 44.7,29.97 v44.7,31.62
  Bottom 0.254: v44.7,31.62 44.7,31.75 44.45,32 44.45,36.45 v44.7,36.7
DTR  (via drill 0.3)
  Top 0.254: IC2.23 47.51,39.89 48.77,41.15 52.32,41.15 v52.58,40.89 | v79.12,65.28 78.49,65.28
  Top 0.305: R11.1 77.6,62.61
  Top 0.406: 77.6,62.61 78.49,63.5 78.49,65.28 78.49,66.55 79.31,67.37 Q2.2
  Bottom 0.254: v79.12,65.28 79.25,65.28 79.38,65.15 79.38,39.12 78.74,38.48 54.1,38.48 52.7,39.88 52.7,40.77 v52.58,40.89
EXT_PCB_3.3V  (via drill 0.46)
  Top 0.406: v54.99,17.78 54.99,17.06 X2.4-VCC | J-SD-E.3 55.24,7.49 55.63,7.11 58.8,7.11 59.56,7.87 v59.56,14.1
  Bottom 0.406: v54.99,17.78 55.12,17.91 57.02,17.91 59.56,15.49 v59.56,14.1
EXT_PCB_5V  (via drill 0.36, 0.46)
  Top 0.406: X1.VBUS2 v76.23,7.97 | X1.VBUS1 v71.33,7.97 | J-USB-E.1 72.26,1.65 70.36,3.56 68.71,3.56 67.82,4.45 v67.82,6.35
  Bottom 0.406: v76.23,7.97 76.23,7.14 75.95,6.86 71.5,6.86 71.33,7.03 v71.33,7.97 71.23,7.87 68.71,7.87 67.82,6.98 v67.82,6.35
EXT_PCB_CC1
  Top 0.254: R4.2 79.87,8.65 79.63,8.89 72.77,8.89 72.53,8.65 X1.A5
EXT_PCB_CC2  (via drill 0.3)
  Top 0.254: R1.2 79.87,4.31 | 79.87,4.31 79.88,4.32 | 79.87,4.31 79.87,4.43 v79.88,4.45 | X1.B5 75.53,7.53 v75.18,8
  Bottom 0.254: v79.88,4.45 79.88,8.64 79.63,8.89 75.44,8.89 75.18,8.64 v75.18,8
EXT_PCB_D+
  Top 0.305: X1.B6 74.53,5.57 74.3,5.33 73.79,5.33 | 73.79,5.33 73.53,5.59 73.53,6.6 | J-USB-E.3 73.79,2.92 73.79,5.33
EXT_PCB_D-  (1 unrouted)
  Top 0.305: X1.A7 74.03,7.76 73.91,7.87 73.15,7.87 73.03,7.75 73.03,4.71 J-USB-E.2
EXT_PCB_GND  (via drill 0.36)
  Top 0.305: v52.83,17.78 52.83,17.07 X2.6-GND
  Bottom 0.305: J-SD-E.5 58.17,8.64 59.18,9.65 59.18,12.19 57.66,13.72 54.74,13.72 52.83,15.62 v52.83,17.78
  other vias: 60.96,3.56 77.34,8 78.23,8 79.12,8
  pour Top (isolate 0.356): 43.81,20.07 84.45,20.07 84.45,-1.52 43.81,-1.52
  pour Bottom (isolate 0.356): 44.45,19.43 83.82,19.43 83.82,-0.89 44.45,-0.89
EXT_PCB_MISO  (via drill 0.36)
  Top 0.305: X2.7-DO 51.7,15.76 51.05,15.11 50.42,15.11 50.04,14.73 v49.53,14.73
  Bottom 0.305: J-SD-E.6 57.53,11.18 55.63,13.08 53.98,13.08 51.94,15.11 50.42,15.11 50.04,14.73 v49.53,14.73
EXT_PCB_MOSI  (via drill 0.36)
  Top 0.305: X2.3-DI 56.1,15.72 54.99,14.61 52.83,14.61 51.44,13.21 v50.67,13.21 50.8,13.21
  Bottom 0.305: v50.67,13.21 51.82,13.21 52.7,12.32 J-SD-E.2
EXT_PCB_SCK  (via drill 0.36)
  Top 0.305: X2.5-SCK 53.9,15.55 53.59,15.24 52.07,15.24 51.18,14.35 v51.18,14.22
  Bottom 0.305: J-SD-E.4 54.86,11.18 51.82,14.22 v51.18,14.22
EXT_PCB_SD_CS
  Top 0.305: X2.2-CS 57.2,15.8 55.37,13.97 53.09,13.97 51.25,12.13 51.25,9.2 51.82,8.64 J-SD-E.1
GND  (via drill 0.36, 0.41)
  Top 0.254: 42.63,37.96 C4.2 42.77,38.1 45.59,38.1 45.73,37.96 IC2.2 47.51,37.96 IC2.THERM | RN2.8 62.16,62.09 JP1.2 | U1".1 | U1".38 71,96.78 70.74,96.52
  Top 0.305: 64.88,88.25 v64.64,88.01 64.52,88.14 U1".GND | 63.88,88.27 v63.63,88.01 63.52,88.12 IC1.GND | v52.2,102.74 52.58,102.36 52.58,97.66 53.46,96.78 U1".1 IC1.1
  Top 0.406: IC1.38 U1".38
  Bottom 0.305: v10.92,30.73 10.67,30.73 10.54,30.86 10.54,33.91 | 10.54,33.91 10.54,35.81 9.78,36.58 5.97,36.58 v5.84,36.45 | v12.45,33.91 10.54,33.91
  other vias: 72.39,27.56 73.28,27.56 74.17,27.56 75.06,27.56 75.95,27.56 76.83,27.56 69.34,36.07 69.34,39.62 69.34,40.51 69.34,43.94 69.34,47.24 69.34,51.69 69.34,52.45 5.84,35.56 5.84,34.67 5.84,33.78 5.84,32.89 65.15,87.25 64.14,87.25 63.12,87.25 64.64,86.49 63.63,86.49 24.89,49.02 24.89,48.26 24.13,48.26 24.13,49.02 23.37,49.02 23.37,48.26 4.19,67.69 5.08,67.69 5.97,67.69 6.86,67.69 7.75,67.69 8.64,67.69 13.84,89.53 13.84,88.65 13.84,87.76 13.84,86.87 13.84,85.98 13.84,85.09 36.96,92.2 37.85,92.2 38.73,92.2 39.62,92.2 40.51,92.2 41.4,92.2 40.89,97.03 41.78,97.03 42.67,97.03 43.56,97.03 44.45,97.03 45.34,97.03 5.84,32 50.8,33.15 51.69,33.15 52.58,33.15 53.47,33.15 54.36,33.15 55.24,33.15 36.96,28.7 37.85,28.7 38.73,28.7 39.62,28.7 40.51,28.7 41.4,28.7 45.85,34.42 45.85,33.53 45.85,32.64 45.85,31.75 38.99,38.86 38.99,37.97 38.99,37.08 38.99,36.2 38.99,35.31 38.99,34.42 49.78,44.07 50.67,44.07 51.56,44.07 52.45,44.07 53.34,44.07 54.23,44.07 13.72,44.83 13.72,45.72 13.72,46.61 13.72,47.5 13.72,48.39 13.72,49.28 55.63,62.99 55.63,62.1 55.63,61.21 55.63,60.33 55.63,59.44 55.63,58.55 54.74,70.99 55.63,70.99 56.52,70.99 57.4,70.99 58.29,70.99 59.18,70.99 66.93,70.99 67.82,70.99 68.71,70.99 69.6,70.99 70.48,70.99 77.34,73.53 77.34,74.42 77.34,75.31 77.34,76.2 77.34,77.09 77.34,77.98 75.56,46.1 75.56,41.66 75.56,42.55 75.56,43.43 75.56,44.32 75.56,45.21 71.25,60.2 72.14,60.2 73.03,60.2 73.91,60.2 74.8,60.2 75.69,60.2 42.8,73.15 43.69,73.15 44.58,73.15 45.47,73.15 46.35,73.15 47.24,73.15 68.58,87.63 68.58,86.74 68.58,85.85 68.58,84.96 68.58,84.07 68.58,83.19 2.67,102.11 3.56,102.11 4.45,102.11 5.33,102.11 6.22,102.11 7.11,102.11 47.75,102.74 48.64,102.74 49.53,102.74 50.42,102.74 51.31,102.74 63.75,46.23 63.75,45.34 63.75,44.45 63.75,43.56 63.75,42.67 63.75,41.78 63.25,32.13 63.25,33.02 63.25,33.91 63.25,34.8 63.25,35.69
  pour Top (isolate 0.356): -3.17,107.06 84.45,107.06 84.45,21.97 -3.17,21.97
  pour Bottom (isolate 0.356): -2.54,106.43 83.57,106.68 83.82,22.61 -2.54,22.61
MISO  (via drill 0.36)
  Top 0.305: v37.21,57.91 v37.21,79.63 | U1".24 70.23,80.52 69.85,80.9 59.18,80.9 58.93,81.15 v58.29,81.15
  Top 0.406: IC1.24 70.45,79 U1".24
  Bottom 0.305: J-SD.6 32,35.05 30.73,36.32 29.21,36.32 27.81,37.72 27.81,40.51 37.21,49.91 v37.21,57.91 | v37.21,79.63 37.34,79.76 56.64,79.76 58.04,81.15 v58.29,81.15
MOSI  (via drill 0.36)
  Top 0.305: v35.18,57.91 v35.18,78.23 | J2.SDA" v28.45,78.24 v28.45,78.23 | U1".23 68.96,80.14 68.83,80.26 v58.29,80.26
  Top 0.406: U1".23 68.96,77.98 69.47,77.47 72.76,77.47 IC1.23
  Top 0.864: J2.SDA J2.SDA"
  Bottom 0.305: 27.3,35.05 J-SD.2 26.54,35.69 26.54,41.02 35.18,49.66 v35.18,57.91 | v28.45,78.23 v35.18,78.23 37.08,78.23 37.97,79.12 57.15,79.12 v58.29,80.26
N$1
  Top 0.254: L1.A 59.19,50.56 57.72,49.08 RN1.8
N$2
  Top 0.254: RN1.7 57.77,48.28 58.17,47.88 59.18,47.88
  Top 0.406: 59.18,47.88 L2.A
N$3  (via drill 0.6)
  Top 0.508: v28.7,53.21 28.19,53.21 27.94,52.96
  Top 2.54: 25.91,52.96 27.94,52.96 28.45,52.96
  other vias: 27.18,52.58 25.53,53.21 24.13,53.98 30.23,53.98 31.62,54.86 22.73,54.86 32.51,56.39 21.84,56.39 32.26,57.91 22.1,57.91 31.37,59.44 22.86,59.44 24.38,59.82 29.97,59.82 28.7,59.06 25.65,59.06 27.18,58.42
  pour Bottom: 31.62,52.2 arc-90 22.73,52.2 arc-90 22.73,61.09 arc-90 31.62,61.09 arc-90
  pour Top: 22.73,52.2 arc90 31.62,52.2 arc90 31.62,61.09 arc90 22.73,61.09 arc90
N$4
  Top 0.457: JP3.1 11.05,60.45 11.3,60.71 11.3,69.98 11.56,70.23
  Top 0.61: IC5.14 3.81,71.5 5.08,70.23 11.56,70.23 19.5,70.23 U$5.+
  Bottom 0.61: BAT.+ U$5.+ 21.84,67.82
N$5
  Top 0.457: D1.A 3.31,58.8 R13.2
N$6
  Top 0.254: L4.A 57.91,33.59 57.91,46.1 57.33,46.68 RN1.5
N$7
  Top 0.254: RN1.6 57.55,47.48 58.42,46.61 58.42,40.81 L3.A
N$13
  Top 0.254: L1.C 62.11,56.27 62.74,56.9 62.74,60.24 JP1.1
N$14
  Top 0.305: R3.2 47.51,53.66 JP2.2
N$15
  Top 0.406: R7.2 R12.1 7.74,82.54 Q3.1
N$18
  Top 0.406: IC1.32 U1".32
N$19
  Top 0.406: Q3.3 8.89,90.12 BUZZER.GND
N$27
  Top 0.406: IC1.20 69.21,73.92 65.15,77.98 U1".20
N$28
  Top 0.406: IC1.19 59.82,73.92 63.88,77.98 U1".19
N$29
  Top 0.406: IC1.22 69.21,76.46 67.69,77.98 U1".22
N$30
  Top 0.406: IC1.21 69.21,75.19 66.42,77.98 U1".21
N$33
  Top 0.406: IC1.17 59.82,76.46 61.34,77.98 U1".17
N$34
  Top 0.406: IC1.18 59.82,75.19 62.61,77.98 U1".18
N$35
  Top 0.457: D1.C 10.97,58.8 JP3.2
N$40
  Top 0.406: R11.2 75.31,62.61 74.42,63.5 74.42,66.55 73.6,67.37 Q1.1
N$41
  Top 0.406: Q2.1 77.41,64.7 R5.2
NEOPIXEL  (via drill 0.36)
  Top 0.305: v38.23,57.91 v38.23,88.77 | v70.74,87.88 IC1.31
  Top 0.406: IC1.31 U1".31
  Bottom 0.305: v38.23,57.91 38.35,44.96 37.72,44.32 J1.2 | v70.74,87.88 69.72,88.9 38.35,88.9 v38.23,88.77
RS485_CS  (via drill 0.36)
  Top 0.305: IC4.2 41.91,53.85 39.75,56.01 v39.75,87.88 | IC1.8 v54.23,87.89 v54.23,87.88
  Top 0.406: U1".8 IC1.8
  Top 0.508: IC4.3 IC4.2
  Bottom 0.305: v54.23,87.88 v39.75,87.88
RS485_RX  (via drill 0.36)
  Top 0.305: IC4.1 43.18,53.47 40.39,56.26 40.39,83.95 v40.51,84.07 | IC1.11 v54.23,84.08 v54.23,84.07
  Top 0.406: U1".11 IC1.11
  Bottom 0.305: v54.23,84.07 v40.51,84.07
RS485_TX  (via drill 0.36)
  Top 0.305: IC4.4 39.37,53.34 38.99,53.59 v38.99,85.34 | v54.23,85.34 v54.23,85.35 IC1.10 U1".10
  Bottom 0.305: v54.23,85.34 v38.99,85.34
RTS  (via drill 0.3)
  Top 0.254: v76.07,66.04 75.5,66.04 | IC2.19 52.29,39.21 v52.32,39.24
  Top 0.406: Q1.2 75.5,66.04 75.5,64.7 R5.1
  Bottom 0.254: v76.07,66.04 79.63,66.04 79.88,65.79 79.88,38.86 78.99,37.97 53.72,37.97 52.45,39.24 v52.32,39.24
RX  (via drill 0.3)
  Top 0.254: IC2.20 49.01,39.87 49.28,40.13 50.74,40.13 v50.93,39.94 | v75.31,92.96 U1".35
  Top 0.406: IC1.35 U1".35
  Bottom 0.254: v75.31,92.96 75.56,92.71 80.26,92.71 80.9,92.08 80.9,38.35 79.5,36.96 52.83,36.96 51.05,38.73 51.05,39.81 v50.93,39.94
RX_LED  (via drill 0.3)
  Top 0.254: IC2.13 56.37,35.96 v56.64,35.69 | v58.67,35.69 58.42,35.94 58.42,38.61 58.8,38.99 60.2,38.99 60.95,39.74 L3.C
  Bottom 0.254: v58.67,35.69 v56.64,35.69
SCK  (via drill 0.36)
  Top 0.305: IC1.13 v54.23,81.54 v54.23,81.53 | J2.SCL" v25.91,81.53 | v36.2,57.91 36.2,78.36 36.45,78.61 v36.45,81.53
  Top 0.406: U1".13 IC1.13
  Top 0.864: J2.SCL J2.SCL"
  Bottom 0.305: J-SD.4 29.59,35.05 27.18,37.34 27.18,40.77 36.2,49.78 v36.2,57.91 | v54.23,81.53 v36.45,81.53 36.32,81.53 v25.91,81.53
SCL  (via drill 0.36)
  Top 0.254: R10.1 77.98,82.17 78.23,82.42 78.23,93.6 77.6,94.23 IC1.36
  Top 0.305: IC6.SCK 14.84,32.41 14.48,32.77 11.56,32.77 11.18,33.15 11.18,35.18 1.52,44.83 1.52,54.61 v1.65,54.74 | U1".36 v69.85,94.24 v69.85,94.23 | v49.78,94.23 49.78,96.52 45.21,101.09 v43.94,101.09 | IC5.16 1.27,73.66 1.4,73.79 1.4,74.68 v1.52,74.8
  Top 0.406: IC1.36 U1".36
  Bottom 0.305: v1.65,54.74 1.65,56.13 1.4,56.39 1.4,74.68 v1.52,74.8 1.4,91.19 13.21,103 42.29,103 43.94,101.22 v43.94,101.09 | v69.85,94.23 v49.78,94.23
SD_CS  (via drill 0.36)
  Top 0.305: v34.29,57.91 v34.29,77.47 | IC1.16 55.38,77.73 55.12,77.47 v54.23,77.47
  Top 0.406: IC1.16 56.64,77.73 56.9,77.47 59.56,77.47 60.07,77.98 U1".16
  Bottom 0.305: J-SD.1 26.29,32.51 25.91,32.77 25.91,41.27 34.29,49.66 v34.29,57.91 | v54.23,77.47 v34.29,77.47
SDA  (via drill 0.36)
  Top 0.305: IC6.DATA 11.32,31.73 10.54,32.51 10.54,34.92 0.89,44.58 0.89,55.63 v0.76,55.75 | IC5.15 2.54,75.31 2.16,75.69 v0.76,75.69 | R2.1 76.83,86.11 76.07,86.87 76.07,89.92 75.56,90.42 IC1.33 | U1".33 71.37,90.43 70.74,91.06 v69.98,91.06 | v50.67,91.06 50.67,96.52 45.21,101.98 v44.58,101.98
  Top 0.406: IC1.33 U1".33
  Bottom 0.305: v0.76,55.75 v0.76,75.69 0.76,91.44 12.95,103.63 42.67,103.63 44.2,101.98 v44.58,101.98 | v69.98,91.06 v50.67,91.06
STAT_LED  (via drill 0.36)
  Top 0.305: RN1.2 51.33,48.28 v51.31,48.26 | v51.31,57.91 v51.31,78.23 | v58.29,82.93 59.05,82.93 59.82,82.17 70.23,82.17 70.87,82.8 70.87,84.71 71.51,85.35 IC1.29 U1".29
  Bottom 0.305: v51.31,48.26 v51.31,57.91 | v51.31,78.23 57.66,78.23 59.18,79.76 59.18,82.68 58.93,82.93 v58.29,82.93
SW_DOWN  (via drill 0.3)
  Top 0.254: RN2.2 64.98,57.96 65.09,57.85 | 65.09,57.85 66.42,56.52 66.42,50.29 67.31,49.4 67.31,42.67 67.7,42.28 S5.B2 | U1".4 57.4,92.97 60.45,89.92 60.45,85.85 61.21,85.09 62.99,85.09 63.25,85.34 64.14,85.34 v64.26,85.47 | v64.9,57.28 64.9,57.66 65.09,57.85
  Top 0.406: IC1.4 U1".4
  Bottom 0.254: v64.26,85.47 64.26,84.2 64.14,84.07 64.14,57.66 64.52,57.28 v64.9,57.28
SW_MENU  (via drill 0.3)
  Top 0.254: RN2.4 66.58,59.82 | 66.58,59.82 66.58,59.03 67.08,58.52 S3.B2 | U1".6 57.4,90.43 59.44,88.39 59.44,85.34 60.71,84.07 63.12,84.07 63.37,83.82 65.91,83.82 v66.04,83.95 | v67.44,59.82 66.58,59.82
  Top 0.406: IC1.6 U1".6
  Bottom 0.254: v66.04,83.95 66.04,61.21 v67.44,59.82
SW_OK  (via drill 0.3)
  Top 0.254: RN2.1 64.18,56.98 | 64.18,56.98 65.91,55.25 65.91,50.04 66.8,49.15 66.8,35.05 67.3,34.55 S6.B2 | U1".5 57.4,91.7 59.94,89.15 59.94,85.6 60.96,84.58 v63.63,84.58 | v63.63,57.02 64.14,57.02 64.18,56.98
  Top 0.406: IC1.5 U1".5
  Bottom 0.254: v63.63,84.58 v63.63,57.02
SW_UP  (via drill 0.3)
  Top 0.254: RN2.3 65.78,58.94 66.1,58.61 | 66.1,58.61 66.93,57.78 66.93,50.55 67.33,50.14 S4.B2 | U1".7 57.4,89.16 58.93,87.63 58.93,84.96 60.33,83.57 62.87,83.57 63.25,83.19 65.28,83.19 v65.41,83.06 | v65.66,58.17 66.1,58.61
  Top 0.406: IC1.7 U1".7
  Bottom 0.254: v65.41,83.06 65.41,58.42 v65.66,58.17
TFT_BLK  (via drill 0.36)
  Top 0.305: IC1.37 U1".37 | U1".37 | U1".37 72.39,95.51 v72.14,95.25
  Top 0.864: J2.BLK J2.BLK"
  Bottom 0.305: J2.BLK" 38.61,96.14 39.37,95.38 65.41,95.38 65.53,95.25 v72.14,95.25
TFT_CS  (via drill 0.36)
  Top 0.305: J2.CS" 36.07,97.92 34.54,96.39 v34.54,80.39 | U1".26 IC1.26 59.56,81.54 59.05,82.04 v58.29,82.04
  Top 0.864: J2.CS J2.CS"
  Bottom 0.305: v34.54,80.39 56.13,80.39 57.78,82.04 v58.29,82.04
TFT_DC  (via drill 0.36)
  Top 0.305: J2.DC" v33.53,82.81 | IC1.12 54.36,82.81 v54.23,82.8
  Top 0.406: U1".12 IC1.12
  Top 0.864: J2.DC J2.DC"
  Bottom 0.305: v33.53,82.81 v54.23,82.81 v54.23,82.8
TFT_RST  (via drill 0.36)
  Top 0.305: IC1.9 v54.23,86.62 v54.23,86.61 | J2.RST" v30.99,86.62 v30.99,86.61
  Top 0.406: U1".9 IC1.9
  Top 0.864: J2.RST J2.RST"
  Bottom 0.305: v54.23,86.61 v30.99,86.61
TX  (via drill 0.3)
  Top 0.254: IC2.21 48.51,40.13 49.02,40.64 51.56,40.64 51.94,40.26 v51.94,40.01 | IC1.34 75.19,91.7 v75.31,91.82
  Top 0.406: IC1.34 U1".34
  Bottom 0.254: v75.31,91.82 75.56,92.08 80.14,92.08 80.39,91.82 80.39,38.61 79.25,37.47 53.09,37.47 51.56,38.99 51.56,39.5 51.94,39.88 v51.94,40.01
TX_LED
  Top 0.254: IC2.14 57.01,36.46 57.4,36.07 57.4,32.38 58.55,31.24 60.45,31.24 60.96,31.75
  Top 0.279: 60.96,31.75 60.96,32.29 L4.C

### Text on the board
tPlace: V1.0 | 2021/02 | STAIR LIGHT CONTROLLER | MicroSD | USB-C | JLCJLCJLCJLC | JLCJLCJLCJLC